# EAGLE design palm (EAGLE 9.3.0)
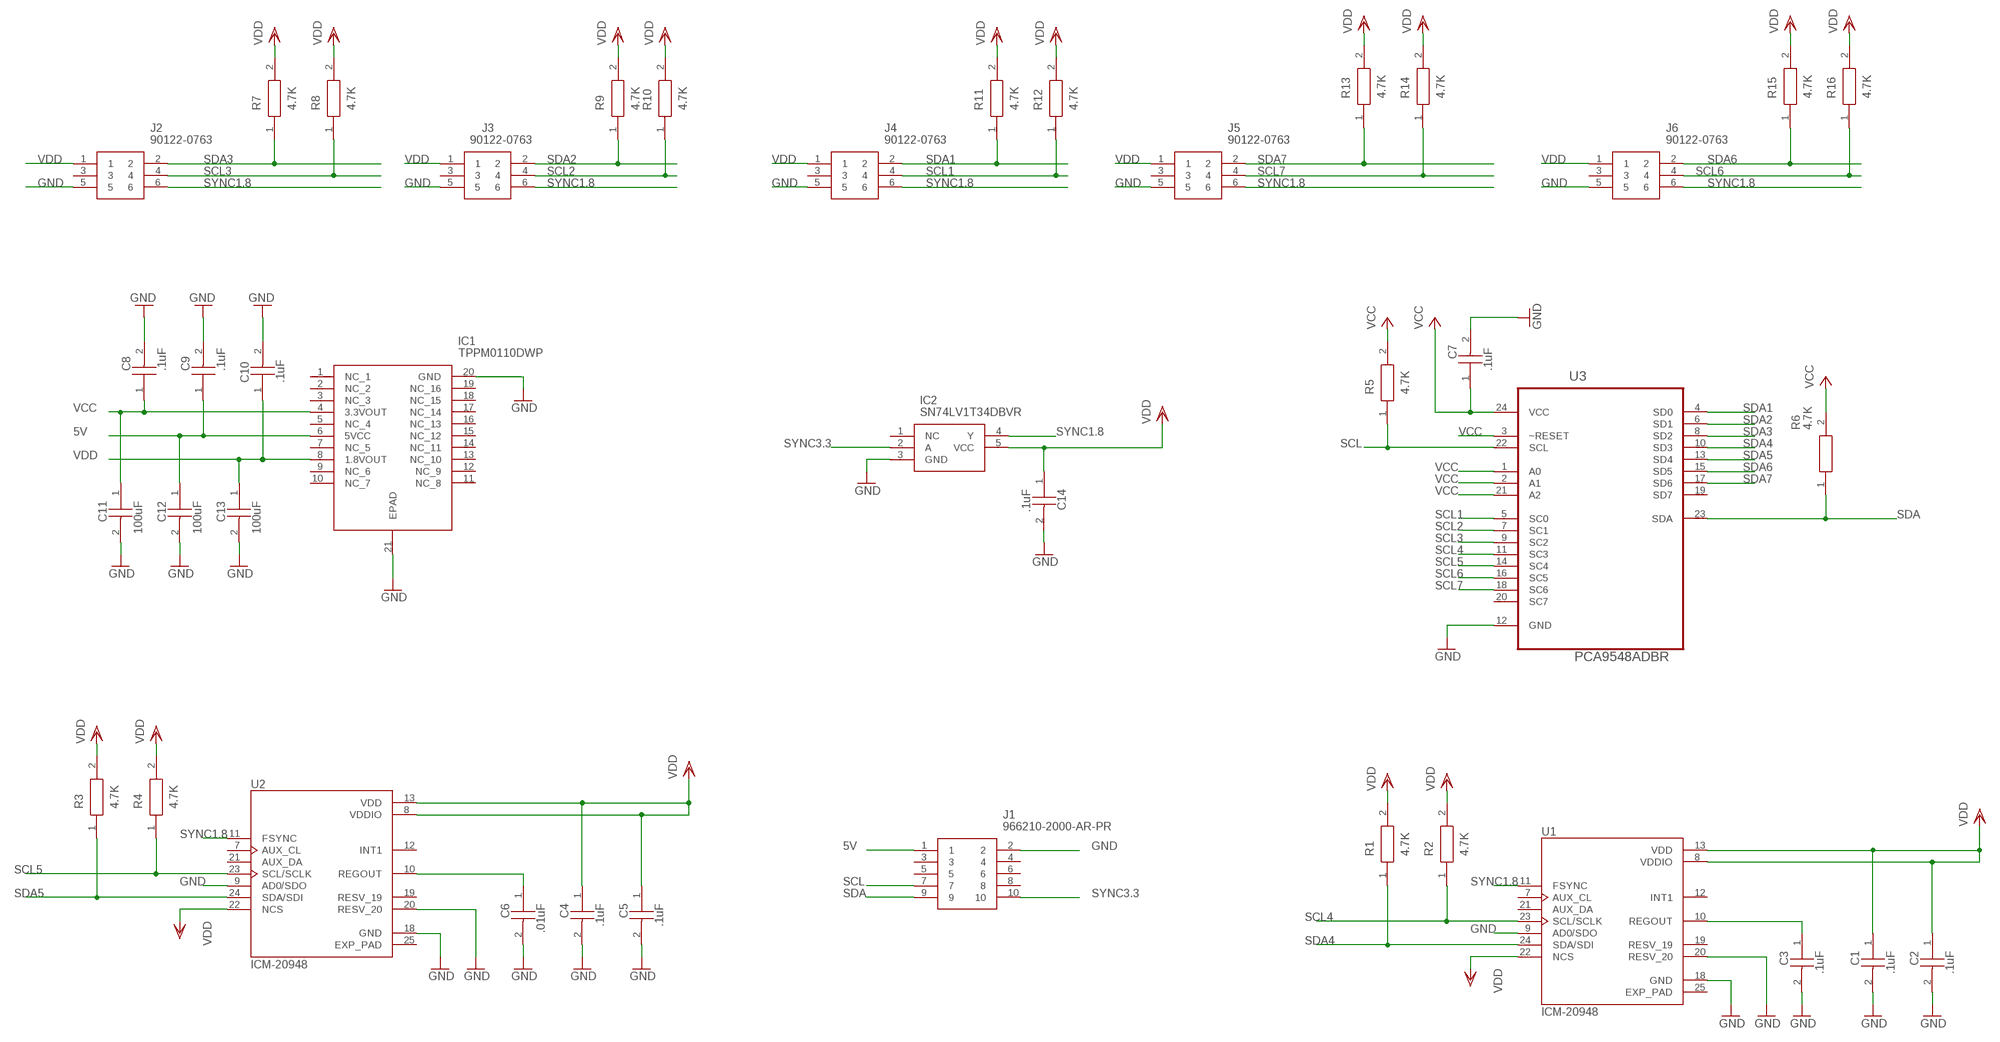
[diagram p0: schematic, sheet 1]

## Parts
C1  .1uF  C0805C104K6RACTU  [CAPC2012X88N]
C2  .1uF  C0805C104K6RACTU  [CAPC2012X88N]
C3  .1uF  C0805C104K6RACTU  [CAPC2012X88N]
C4  .1uF  C0805C104K6RACTU  [CAPC2012X88N]
C5  .1uF  C0805C104K6RACTU  [CAPC2012X88N]
C6  .01uF  C0805C104K6RACTU  [CAPC2012X88N]
C7  .1uF  C0805C104K6RACTU  [CAPC2012X88N]
C8  .1uF  C0805C104K6RACTU  [CAPC2012X88N]
C9  .1uF  C0805C104K6RACTU  [CAPC2012X88N]
C10  .1uF  C0805C104K6RACTU  [CAPC2012X88N]
C11  100uF  12106D107MAT2A  [CAPC3225X279N]
C12  100uF  12106D107MAT2A  [CAPC3225X279N]
C13  100uF  12106D107MAT2A  [CAPC3225X279N]
C14  .1uF  C0805C104K6RACTU  [CAPC2012X88N]
IC1  TPPM0110DWP  [SOIC127P1040X265-21N]
IC2  SN74LV1T34DBVR  [SOT95P280X145-5N]
J1  966210-2000-AR-PR  [966210-2000-AR-PR]
J2  90122-0763  [SHDR6W90P254_2X3_762X605X684P]
J3  90122-0763  [SHDR6W90P254_2X3_762X605X684P]
J4  90122-0763  [SHDR6W90P254_2X3_762X605X684P]
J5  90122-0763  [SHDR6W90P254_2X3_762X605X684P]
J6  90122-0763  [SHDR6W90P254_2X3_762X605X684P]
R1  4.7K  CRCW12064K70FKEBC  [RESC3216X60N]
R2  4.7K  CRCW12064K70FKEBC  [RESC3216X60N]
R3  4.7K  CRCW12064K70FKEBC  [RESC3216X60N]
R4  4.7K  CRCW12064K70FKEBC  [RESC3216X60N]
R5  4.7K  CRCW12064K70FKEBC  [RESC3216X60N]
R6  4.7K  CRCW12064K70FKEBC  [RESC3216X60N]
R7  4.7K  CRCW12064K70FKEBC  [RESC3216X60N]
R8  4.7K  CRCW12064K70FKEBC  [RESC3216X60N]
R9  4.7K  CRCW12064K70FKEBC  [RESC3216X60N]
R10  4.7K  CRCW12064K70FKEBC  [RESC3216X60N]
R11  4.7K  CRCW12064K70FKEBC  [RESC3216X60N]
R12  4.7K  CRCW12064K70FKEBC  [RESC3216X60N]
R13  4.7K  CRCW12064K70FKEBC  [RESC3216X60N]
R14  4.7K  CRCW12064K70FKEBC  [RESC3216X60N]
R15  4.7K  CRCW12064K70FKEBC  [RESC3216X60N]
R16  4.7K  CRCW12064K70FKEBC  [RESC3216X60N]
U1  ICM-20948  [QFN40P300X300X105-25N]
U2  ICM-20948  [QFN40P300X300X105-25N]
U3  PCA9548ADBR  [SOP65P780X200-24N]

## Nets
5V: C9.1 C12.1(C1) IC1.6(5VCC) J1.1
GND: C1.2 C2.2 C3.2 C4.2 C5.2 C6.2 C7.2 C8.2 C9.2 C10.2 C11.2(C2) C12.2(C2) C13.2(C2) C14.2 IC1.20(GND) IC1.21(EPAD) IC2.3(GND) J1.2 J2.5 J3.5 J4.5 J5.5 J6.5 U1.9(AD0/SDO) U1.18(GND) U1.20(RESV_20) U2.9(AD0/SDO) U2.18(GND) U2.20(RESV_20) U3.12(GND)
N$1: C6.1 U2.10(REGOUT)
N$3: C3.1 U1.10(REGOUT)
SCL: J1.7 R5.1 U3.22(SCL)
SCL1: J4.4 R12.1 U3.5(SC0)
SCL2: J3.4 R10.1 U3.7(SC1)
SCL3: J2.4 R8.1 U3.9(SC2)
SCL4: R2.1 U1.23(SCL/SCLK) U3.11(SC3)
SCL5: R4.1 U2.23(SCL/SCLK) U3.14(SC4)
SCL6: J6.4 R16.1 U3.16(SC5)
SCL7: J5.4 R14.1 U3.18(SC6)
SDA: J1.9 R6.1 U3.23(SDA)
SDA1: J4.2 R11.1 U3.4(SD0)
SDA2: J3.2 R9.1 U3.6(SD1)
SDA3: J2.2 R7.1 U3.8(SD2)
SDA4: R1.1 U1.24(SDA/SDI) U3.10(SD3)
SDA5: R3.1 U2.24(SDA/SDI) U3.13(SD4)
SDA6: J6.2 R15.1 U3.15(SD5)
SDA7: J5.2 R13.1 U3.17(SD6)
SYNC1.8: IC2.4(Y) J2.6 J3.6 J4.6 J5.6 J6.6 U1.11(FSYNC) U2.11(FSYNC)
SYNC3.3: IC2.2(A) J1.10
VCC: C7.1 C8.1 C11.1(C1) IC1.4(3.3VOUT) R5.2 R6.2 U3.1(A0) U3.2(A1) U3.3(~RESET) U3.21(A2) U3.24(VCC)
VDD: C1.1 C2.1 C4.1 C5.1 C10.1 C13.1(C1) C14.1 IC1.8(1.8VOUT) IC2.5(VCC) J2.1 J3.1 J4.1 J5.1 J6.1 R1.2 R2.2 R3.2 R4.2 R7.2 R8.2 R9.2 R10.2 R11.2 R12.2 R13.2 R14.2 R15.2 R16.2 U1.8(VDDIO) U1.13(VDD) U1.22(NCS) U2.8(VDDIO) U2.13(VDD) U2.22(NCS)
Unconnected: IC1.1(NC_1) IC1.2(NC_2) IC1.3(NC_3) IC1.5(NC_4) IC1.7(NC_5) IC1.9(NC_6) IC1.10(NC_7) IC1.11(NC_8) IC1.12(NC_9) IC1.13(NC_10) IC1.14(NC_11) IC1.15(NC_12) IC1.16(NC_13) IC1.17(NC_14) IC1.18(NC_15) IC1.19(NC_16) IC2.1(NC) J1.3 J1.4 J1.5 J1.6 J1.8 J2.3 J3.3 J4.3 J5.3 J6.3 U1.7(AUX_CL) U1.12(INT1) U1.19(RESV_19) U1.21(AUX_DA) U2.7(AUX_CL) U2.12(INT1) U2.19(RESV_19) U2.21(AUX_DA) U3.19(SD7) U3.20(SC7)

## Power pins joined to a net without a drawn wire
EXP_PAD: U1.25(EXP_PAD) U2.25(EXP_PAD)

## Library data of the parts
C1-C10 C14 = SamacSys_Parts:C0805C104K6RACTU: KEMET - C0805C104K6RACTU - CAP, MLCC, X7R, 0.1UF, 35V, 0805 Source: Datasheet <https://componentsearchengine.com/Datasheets/1/C0805C104K6RACTU.pdf>; DESCRIPTION: KEMET - C0805C104K6RACTU - CAP, MLCC, X7R, 0.1UF, 35V, 0805; HEIGHT: 0.88mm; MANUFACTURER_NAME: Kemet; MANUFACTURER_PART_NUMBER: C0805C104K6RACTU; MOUSER_PART_NUMBER: 80-C0805C104K6R
C11-C13 = SamacSys_Parts:12106D107MAT2A: Capacitor 1210 100UF 20% 6.3V Source: Datasheet <https://componentsearchengine.com/Datasheets/1/12106D107MAT2A.pdf>; DESCRIPTION: Capacitor 1210 100UF 20% 6.3V; HEIGHT: mm; MANUFACTURER_NAME: AVX; MANUFACTURER_PART_NUMBER: 12106D107MAT2A; MOUSER_PART_NUMBER: 581-12106D107MAT2A
IC1 = SamacSys_Parts:TPPM0110DWP: LDO Voltage Regulators Dual-Output 3.3V & 1.8V Source: Datasheet <http://www.ti.com/lit/ds/symlink/tppm0110.pdf>; DESCRIPTION: LDO Voltage Regulators Dual-Output 3.3V & 1.8V; HEIGHT: 2.65mm; MANUFACTURER_NAME: Texas Instruments; MANUFACTURER_PART_NUMBER: TPPM0110DWP; MOUSER_PART_NUMBER: 595-TPPM0110DWP
IC2 = SamacSys_Parts:SN74LV1T34DBVR: Single Power Supply BUFFER Logic Level Shifter (no enable) Source: Datasheet <http://www.ti.com/lit/gpn/sn74lv1t34>; DESCRIPTION: Single Power Supply BUFFER Logic Level Shifter (no enable); HEIGHT: 1.45mm; MANUFACTURER_NAME: Texas Instruments; MANUFACTURER_PART_NUMBER: SN74LV1T34DBVR; MOUSER_PART_NUMBER: 595-SN74LV1T34DBVR
J1 = SamacSys_Parts:966210-2000-AR-PR: Headers & Wire Housings 10P DUAL ENT DR SKT SMT LO PROFILE Source: Datasheet <https://componentsearchengine.com/Datasheets/1/966210-2000-AR-PR.pdf>; DESCRIPTION: Headers & Wire Housings 10P DUAL ENT DR SKT SMT LO PROFILE; HEIGHT: mm; MANUFACTURER_NAME: 3M; MANUFACTURER_PART_NUMBER: 966210-2000-AR-PR; MOUSER_PART_NUMBER: 517-9662102000ARPR
J2-J6 = SamacSys_Parts:90122-0763: Molex C-GRID III Series, Series Number 90122, 2.54mm Pitch 6 Way 2 Row Right Angle PCB Header, Solder Termination, 3A Source: Datasheet <http://www.mouser.com/datasheet/2/276/0901220763_PCB_HEADERS-230116.pdf>; DESCRIPTION: Molex C-GRID III Series, Series Number 90122, 2.54mm Pitch 6 Way 2 Row Right Angle PCB Header, Solder Termination, 3A; HEIGHT: 6.84mm; MANUFACTURER_NAME: Molex; MANUFACTURER_PART_NUMBER: 90122-0763; MOUSER_PART_NUMBER: 538-90122-0763; MOUSER_PRICE-STOCK: https://www.mouser.com/Search/Refine.aspx?Keyword=538-90122-0763
R1-R16 = SamacSys_Parts:CRCW12064K70FKEBC: Thick Film Resistors - SMD 1/4Watt 4.7Kohms 1% Commercial Use Source: Datasheet <https://componentsearchengine.com/Datasheets/1/CRCW12064K70FKEBC.pdf>; DESCRIPTION: Thick Film Resistors - SMD 1/4Watt 4.7Kohms 1% Commercial Use; HEIGHT: 0.6mm; MANUFACTURER_NAME: Vishay; MANUFACTURER_PART_NUMBER: CRCW12064K70FKEBC; MOUSER_PART_NUMBER: 71-CRCW12064K70FKEBC
U1 U2 = ICM-20948:ICM-20948: Axis=3 Axis Gyro+3 Axis Accel+Compass. Pin For Pin With m; DESCRIPTION: 9 Axis=3 Axis Gyro+3 Axis Accel+Compass. Pin For Pin With m; DIGI-KEY_PART_NUMBER: 1428-1123-1-ND; DIGI-KEY_PURCHASE_URL: https://www.digikey.com/product-detail/en/tdk-invensense/ICM-20948/1428-1123-1-ND/7062698?utm_source=snapeda&utm_medium=aggregator&utm_campaign=symbol; MF: TDK InvenSense; MP: ICM-20948; PACKAGE: QFN-24 InvenSense
U3 = PCA9548ADBR:PCA9548ADBR: 8-CHANNEL I2C SWITCH; AVAILABILITY: Unavailable; DESCRIPTION: 8-Channel I2C Switch With Reset 24-SSOP -40 to 85; MF: Texas Instruments; MP: PCA9548ADBR; PACKAGE: SSOP-24 Texas Instruments; PRICE: None

## Board
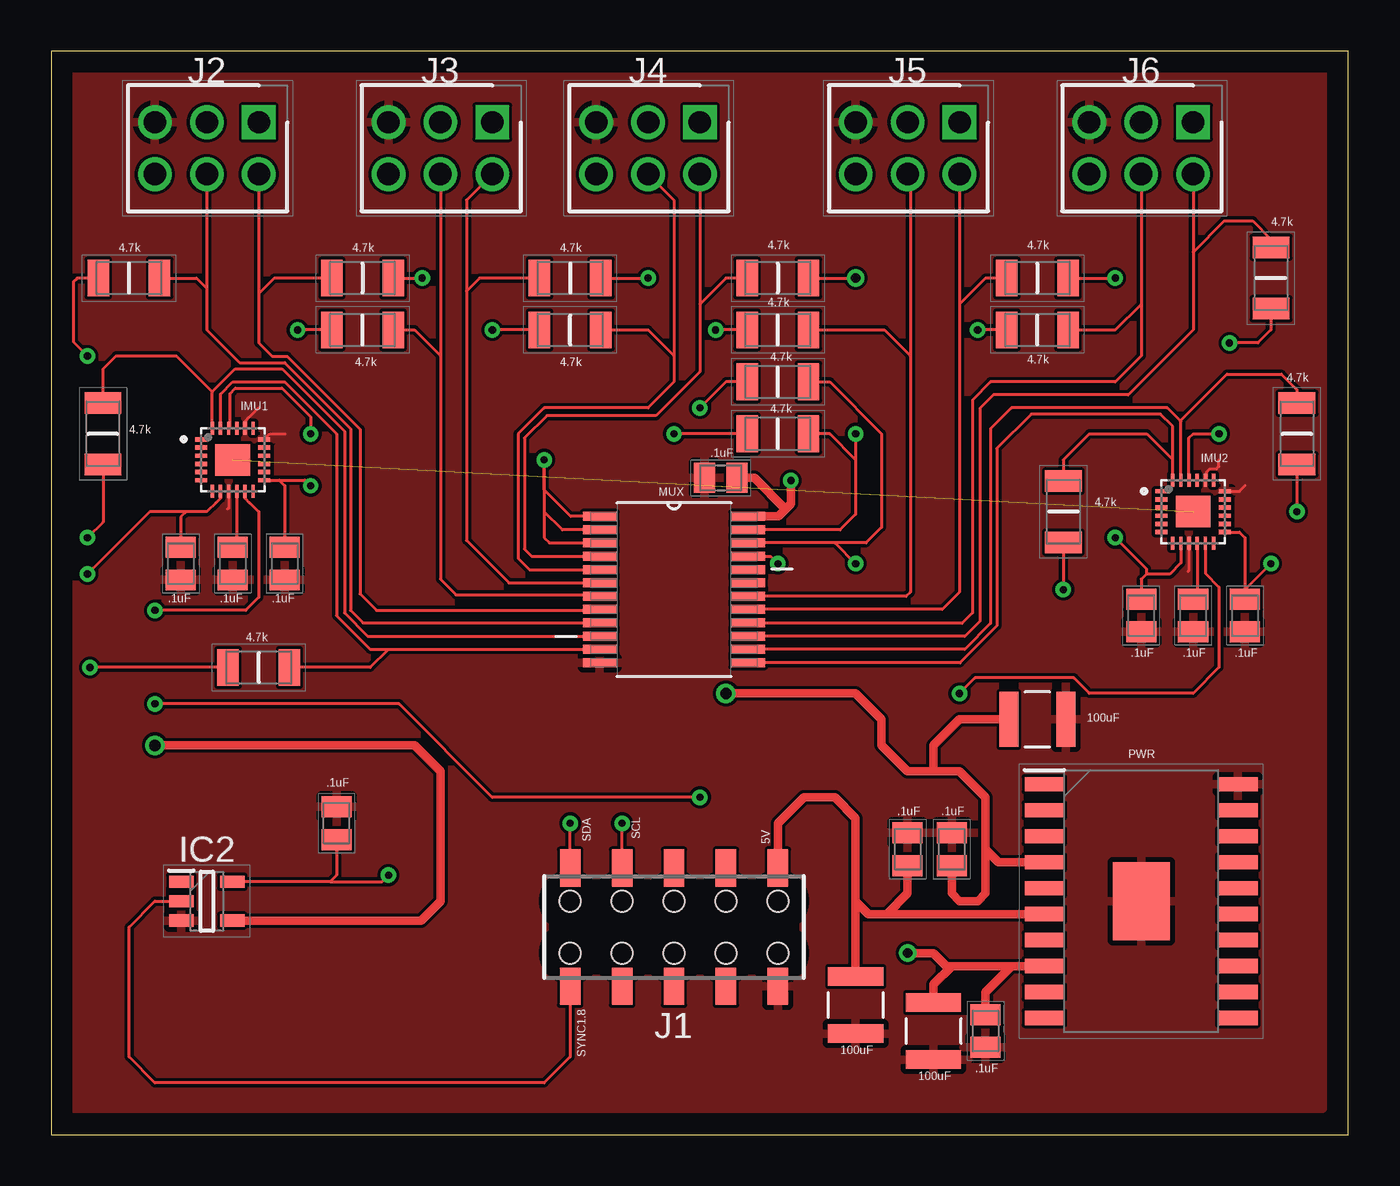
[diagram p1: board, top side]
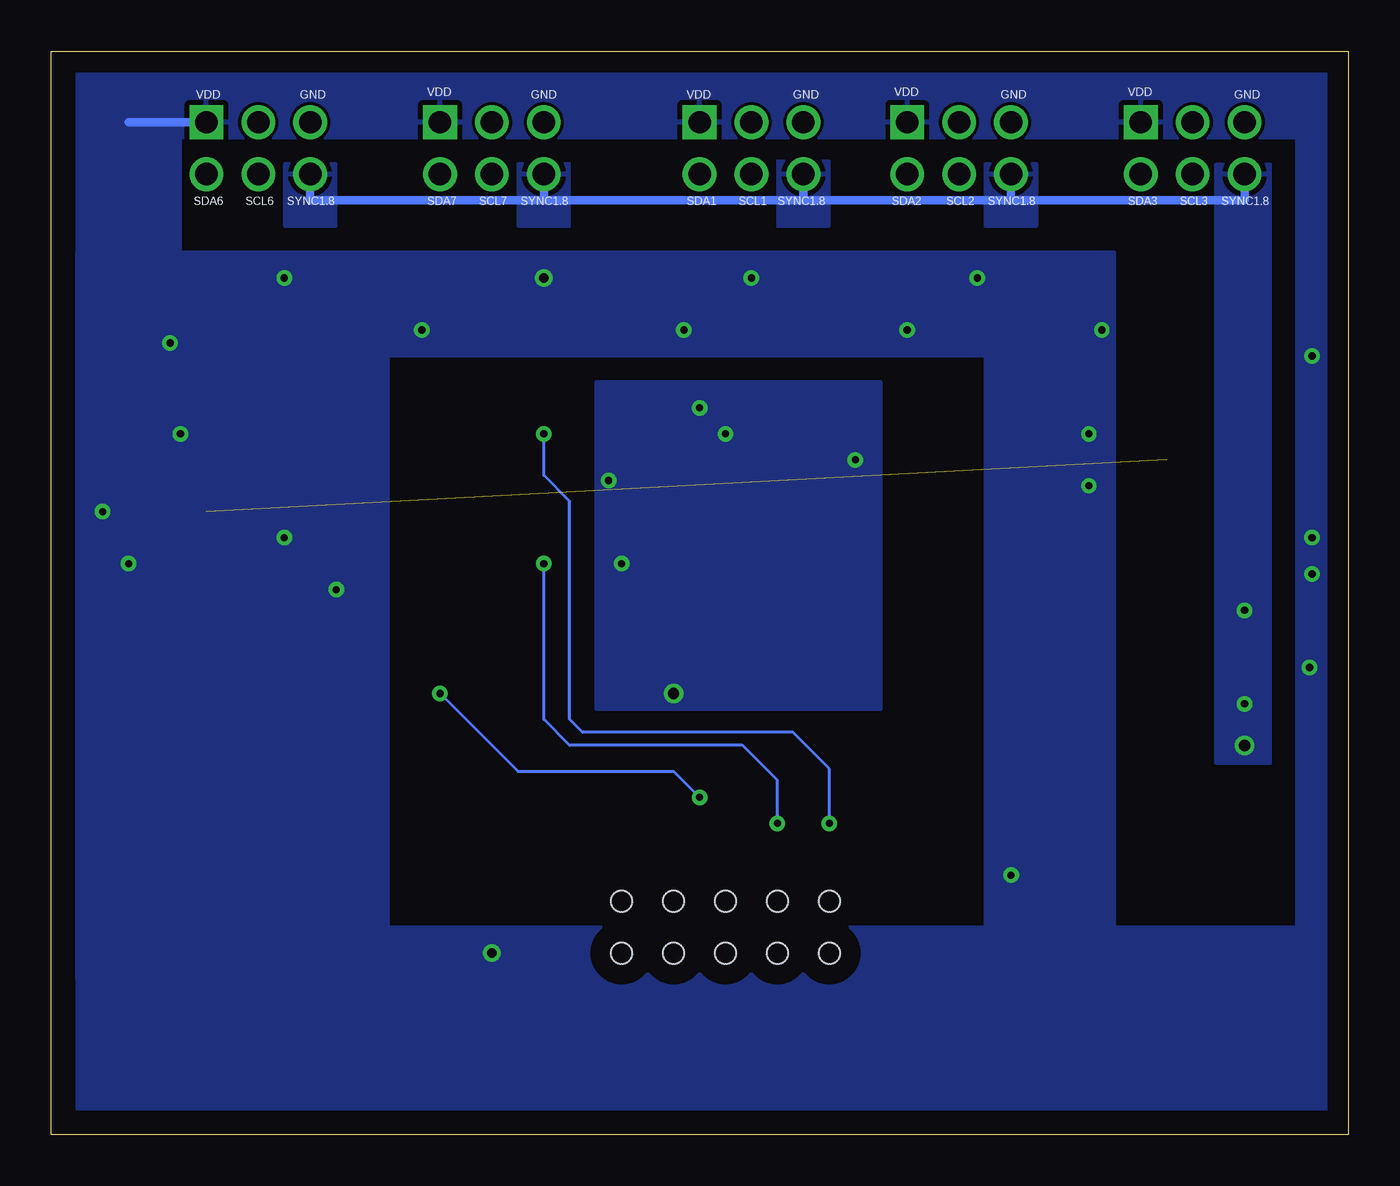
[diagram p2: board, bottom side, seen from below]

Size 63.48 x 53.01 mm. Coordinates in mm from the lower left corner, seen from the top.
Outline: 0,0 63.48,0 63.48,53.01 0,53.01 0,0
Copper layers (1*16): Top 0.035mm / dielectric 1.5mm / Bottom 0.035mm
Design rules "default": minimum track width 6mil, minimum drill 0.35mm, track to track 6mil, track to pad 6mil, pad to pad 6mil, via to via 6mil, smd to smd 6mil, copper to edge 40mil, drill to drill 6mil, minimum pad ring 10mil, minimum via ring 8mil, stop-mask expansion 4mil, vias tented up to drill 0mil, thermal gap 10mil

### Footprints (pad centres in the part's own frame; a part is rotated, then mirrored left to right if it is on the bottom)
CAPC2012X88N = smd 1.02 x 1.47: 1 -0.8,0; 2 0.8,0
CAPC3225X279N = smd 0.914 x 2.692: 1 -1.397,0; 2 1.397,0
SOIC127P1040X265-21N = smd 1.94 x 0.7: 1 -4.73,5.715; 2 -4.73,4.445; 3 -4.73,3.175; 4 -4.73,1.905; 5 -4.73,0.635; 6 -4.73,-0.635; 7 -4.73,-1.905; 8 -4.73,-3.175; 9 -4.73,-4.445; 10 -4.73,-5.715; 11 4.73,-5.715; 12 4.73,-4.445; 13 4.73,-3.175; 14 4.73,-1.905; 15 4.73,-0.635; 16 4.73,0.635; 17 4.73,1.905; 18 4.73,3.175; 19 4.73,4.445; 20 4.73,5.715 | smd 2.79 x 3.81: 21 0,0
SOT95P280X145-5N = smd 1.2 x 0.6: 1 -1.25,0.95; 2 -1.25,0; 3 -1.25,-0.95; 4 1.25,-0.95; 5 1.25,0.95
966210-2000-AR-PR = smd 1 x 1.82: 1 -5.08,-2.89; 2 -5.08,2.89; 3 -2.54,-2.89; 4 -2.54,2.89; 5 0,-2.89; 6 0,2.89; 7 2.54,-2.89; 8 2.54,2.89; 9 5.08,-2.89; 10 5.08,2.89 | hole 1.02: -5.08,-1.27; -5.08,1.27; -2.54,-1.27; -2.54,1.27; 0,-1.27; 0,1.27; 2.54,-1.27; 2.54,1.27; 5.08,-1.27; 5.08,1.27
SHDR6W90P254_2X3_762X605X684P = drill 1.1 pad 1.65 square: 1 0,0 | drill 1.1 pad 1.65: 2 0,2.54; 3 2.54,0; 4 2.54,2.54; 5 5.08,0; 6 5.08,2.54
RESC3216X60N = smd 1.05 x 1.8: 1 -1.5,0; 2 1.5,0
QFN40P300X300X105-25N = smd 0.64 x 0.22: 1 -1.545,1; 2 -1.545,0.6; 3 -1.545,0.2; 4 -1.545,-0.2; 5 -1.545,-0.6; 6 -1.545,-1; 13 1.545,-1; 14 1.545,-0.6; 15 1.545,-0.2; 16 1.545,0.2; 17 1.545,0.6; 18 1.545,1 | smd 0.22 x 0.64: 7 -1,-1.545; 8 -0.6,-1.545; 9 -0.2,-1.545; 10 0.2,-1.545; 11 0.6,-1.545; 12 1,-1.545; 19 1,1.545; 20 0.6,1.545; 21 0.2,1.545; 22 -0.2,1.545; 23 -0.6,1.545; 24 -1,1.545 | smd 1.7 x 1.54: 25 0,0
SOP65P780X200-24N = smd 1.651 x 0.432: 1 -3.632,3.581; 2 -3.632,2.921; 3 -3.632,2.286; 4 -3.632,1.626; 5 -3.632,0.965; 6 -3.632,0.33; 7 -3.632,-0.33; 8 -3.632,-0.965; 9 -3.632,-1.626; 10 -3.632,-2.286; 11 -3.632,-2.921; 12 -3.632,-3.581; 13 3.632,-3.581; 14 3.632,-2.921; 15 3.632,-2.286; 16 3.632,-1.626; 17 3.632,-0.965; 18 3.632,-0.33; 19 3.632,0.33; 20 3.632,0.965; 21 3.632,1.626; 22 3.632,2.286; 23 3.632,2.921; 24 3.632,3.581

### Placement (x,y rotation side)
C1  11.43,27.94 270 top
C2  6.35,27.94 270 top
C3  8.89,27.94 270 top
C4  58.42,25.4 270 top
C5  53.34,25.4 270 top
C6  55.88,25.4 270 top
C7  32.77,32.13 180 top
C8  44.07,13.97 90 top
C9  41.91,13.97 90 top
C10  45.72,5.08 270 top
C11  48.26,20.32 0 top
C12  39.37,6.35 270 top
C13  43.18,5.08 270 top
C14  13.97,15.24 90 top
IC1  53.34,11.43 0 top
IC2  7.62,11.43 0 top
J1  30.48,10.16 180 top
J2  10.16,49.53 180 top
J3  21.59,49.53 180 top
J4  31.75,49.53 180 top
J5  44.45,49.53 180 top
J6  55.88,49.53 180 top
R1  2.54,34.29 270 top
R2  10.16,22.86 180 top
R3  49.53,30.48 270 top
R4  60.96,34.29 270 top
R5  35.56,36.83 180 top
R6  35.56,34.29 180 top
R7  15.24,41.91 0 top
R8  3.81,41.91 180 top
R9  25.4,41.91 0 top
R10  15.24,39.37 180 top
R11  35.56,41.91 0 top
R12  25.4,39.37 180 top
R13  48.26,41.91 0 top
R14  35.56,39.37 180 top
R15  59.69,41.91 270 top
R16  48.26,39.37 180 top
U1  8.89,33.02 0 top
U2  55.88,30.48 0 top
U3  30.48,26.67 0 top

### Tracks (layer width: path | path; a pad name or v marks a point on that pad's centre or on a via)
5V
  Top 0.406: J1.1 35.56,15.24 36.83,16.51 38.35,16.51 39.37,15.49 39.37,11.43 | 39.37,11.43 40.01,10.79 40.89,10.79 | IC1.6 40.89,10.79 | C12.1 39.37,11.43 | C9.1 41.91,11.81 40.89,10.79
EXP_PAD  (1 unrouted)
GND
  Top 0.152: U1.9 8.69,30.66 8.64,30.61 | 10.16,35.56 9.71,35.11 9.7,35.11 9.49,34.9 U1.20 | U1.18 10.71,34.29 11.43,34.29 | U2.9 55.68,27.61 55.63,27.56 | 57.15,33.02 57.15,32.7 57.03,32.57 56.69,32.57 56.54,32.42 56.54,32.09 U2.20 | U2.18 58.15,31.48 58.42,31.75
  pour Top: 0.89,52.07 62.23,52.07 62.23,1.27 0.89,1.27
N$1
  Top 0.152: U2.10 56.08,26.4 C6.1
N$3
  Top 0.152: U1.10 9.09,28.94 C3.1
SCL  (via drill 0.35, 0.35 pad 0.55)
  Top 0.152: R5.1 38.1,36.83 40.64,34.29 40.64,29.72 39.88,28.96 38.35,28.96 | 38.35,28.96 U3.22 | 38.35,28.96 v39.37,27.94 | J1.7 v27.94,15.24
  Bottom 0.152: v27.94,15.24 27.94,17.35 29.64,19.05 38.1,19.05 39.37,20.32 v39.37,27.94
SCL1
  Top 0.152: U3.5 23.42,27.64 22.86,28.19 22.86,34.29 24.13,35.56 29.21,35.56 30.48,36.83 30.48,38.1 | J4.4 30.48,45.72 30.48,38.1 | 30.48,38.1 29.21,39.37 R12.1
SCL2
  Top 0.152: U3.7 26.77,26.42 19.81,26.42 19.05,27.18 19.05,38.1 | J3.4 19.05,38.1 | R10.1 17.78,39.37 19.05,38.1
SCL3
  Top 0.152: J2.4 7.62,41.4 | 7.62,41.4 7.62,39.37 9.22,37.77 11.43,37.77 14.66,34.54 14.66,25.65 15.27,25.04 U3.9 | 7.62,41.4 7.11,41.91 R8.1
SCL4
  Top 0.152: U1.23 8.29,36.23 8.89,36.83 11.43,36.83 13.97,34.29 13.97,25.4 15.62,23.75 16.51,23.75 | 16.51,23.75 U3.11 | R2.1 15.62,22.86 16.51,23.75
SCL5
  Top 0.152: U2.23 55.28,34.89 55.24,34.92 | 55.24,34.92 54.61,35.56 46.99,35.56 45.97,34.54 45.97,25.02 44.7,23.75 U3.14 | R4.1 60.96,36.45 60.2,37.21 57.53,37.21 55.24,34.92
SCL6
  Top 0.152: J6.4 53.34,40.64 | 53.34,40.64 53.34,38.1 52.07,36.83 45.97,36.83 45.09,35.94 45.09,25.53 44.58,25.02 34.14,25.02 U3.16 | R16.1 52.07,39.37 53.34,40.64
SCL7
  Top 0.152: J5.4 42.04,46.86 42.04,38.1 | 42.04,38.1 42.04,26.54 41.83,26.34 U3.18 | R14.1 40.77,39.37 42.04,38.1
SDA  (via drill 0.35, 0.35 pad 0.55)
  Top 0.152: v39.37,34.29 39.37,33.02 | 39.37,33.02 39.37,30.35 38.61,29.59 U3.23 | J1.9 v25.4,15.24 | 39.37,33.02 38.1,34.29 R6.1
  Bottom 0.152: v39.37,34.29 39.37,32.26 38.1,30.99 38.1,20.32 37.47,19.68 27.18,19.68 25.4,17.91 v25.4,15.24
SDA1
  Top 0.152: J4.2 31.75,40.64 | 31.75,40.64 31.75,37.34 29.59,35.18 24.26,35.18 23.16,34.09 23.16,28.65 23.52,28.3 U3.4 | R11.1 33.02,41.91 31.75,40.64
SDA2
  Top 0.152: U3.6 22.4,27 20.32,29.08 20.32,41.27 | J3.2 20.32,45.72 20.32,41.27 | R9.1 20.95,41.91 20.32,41.27
SDA3
  Top 0.152: U3.8 26.8,25.65 15.93,25.65 15.11,26.47 15.11,34.52 11.56,38.08 10.82,38.08 10.16,38.73 10.16,41.15 | J2.2 10.16,41.15 | R7.1 10.92,41.91 10.16,41.15
SDA4
  Top 0.152: U1.24 7.89,36.34 | 7.89,36.34 9.02,37.47 11.3,37.47 14.35,34.42 14.35,25.53 15.49,24.38 U3.10 | R1.1 2.54,37.47 3.17,38.1 6.13,38.1 7.89,36.34
SDA5
  Top 0.152: U2.24 54.88,33.02 | 54.88,33.02 54.88,34.66 54.28,35.26 47.95,35.26 46.28,33.58 46.28,24.89 44.48,23.09 U3.13 | 54.88,33.02 53.61,34.29 50.8,34.29 49.53,33.02 R3.1
SDA6
  Top 0.152: J6.2 55.88,43.18 | 55.88,43.18 55.88,39.37 52.7,36.2 46.1,36.2 45.47,35.56 45.47,25.15 44.7,24.38 U3.15 | 55.88,43.18 57.4,44.7 58.8,44.7 59.69,43.81 R15.1
SDA7
  Top 0.152: U3.17 43.61,25.7 44.45,26.54 44.45,40.64 | J5.2 44.45,40.64 | R13.1 45.72,41.91 44.45,40.64
SYNC1.8  (via drill 0.35, 0.55)
  Top 0.152: U2.11 56.48,27.47 57.15,26.8 57.15,22.86 55.88,21.59 50.8,21.59 50.04,22.35 45.21,22.35 v44.45,21.59 | v31.75,16.51 21.59,16.51 17.02,21.08 v5.08,21.08 | U1.11 9.49,31.14 9.7,30.93 9.71,30.93 10.16,30.48 10.16,26.29 9.53,25.65 v5.08,25.65
  Top 0.406: IC2.4 18.1,10.48 19.05,11.43 19.05,17.78 17.78,19.05 v5.08,19.05
  Bottom 0.152: v31.75,16.51 33.02,17.78 40.64,17.78 v44.45,21.59
  Bottom 0.406: J2.6 5.08,45.72 16.51,45.72 | 16.51,45.72 J3.6 | 16.51,45.72 26.67,45.72 | 26.67,45.72 J4.6 | 26.67,45.72 39.37,45.72 | 39.37,45.72 J5.6 | 39.37,45.72 50.8,45.72 J6.6
  pour Bottom: 3.81,18.16 6.48,18.16 6.48,47.5 3.81,47.5
  pour Bottom: 15.24,47.5 17.78,47.5 17.78,44.45 15.24,44.45
  pour Bottom: 25.4,47.62 27.94,47.62 27.94,44.45 25.4,44.45
  pour Bottom: 38.1,47.5 40.64,47.5 40.64,44.45 38.1,44.45
  pour Bottom: 49.53,47.5 52.07,47.5 52.07,44.45 49.53,44.45
SYNC3.3
  Top 0.152: J1.10 25.4,3.81 24.13,2.54 5.08,2.54 3.81,3.81 3.81,10.16 5.08,11.43 IC2.2
VCC  (via drill 0.35, 0.55)
  Top 0.152: R5.2 33.02,36.83 v31.75,35.56 | R6.2 v30.48,34.29 | U3.1 25.43,30.25 24.13,31.55 v24.13,33.02 24.13,30.48 | 24.13,30.48 24.13,29.21 24.38,28.96 U3.3 | 24.13,30.48 25.02,29.59 U3.2 | U3.21 35.2,28.3 v35.56,27.94
  Top 0.406: 45.72,13.97 45.72,16.51 44.45,17.78 43.18,17.78 | 45.72,13.97 46.35,13.34 IC1.4 | C8.1 44.07,11.81 44.45,11.43 45.34,11.43 45.72,11.81 45.72,13.97 | 43.18,17.78 41.91,17.78 40.64,19.05 40.64,20.32 39.37,21.59 v33.02,21.59 | C11.1 44.45,20.32 43.18,19.05 43.18,17.78 | 33.69,32.26 arc90 C7.1 34.42,32.13 35.94,30.61 | 34.14,30.23 arc-90 U3.24 35.59,30.25 35.94,30.61 | 35.94,30.61 36.2,30.86 v36.2,32
  pour Bottom: 22.86,36.83 36.83,36.83 36.83,20.83 22.86,20.83
VDD  (via drill 0.35, 0.45)
  Top 0.152: U1.8 8.29,31.14 8.08,30.93 8.07,30.93 7.62,30.48 6.6,30.48 | 6.6,30.48 6.35,30.23 C2.1 | C1.1 11.43,31.75 11.16,32.02 U1.13 12.43,32.02 v12.7,31.75 | U2.8 55.28,27.98 54.74,27.43 53.59,27.43 | 53.59,27.43 53.34,27.18 C5.1 | U2.13 58.15,29.48 58.42,29.21 58.42,26.67 | 58.42,26.67 C4.1 | C14.1 13.97,12.7 13.65,12.38 | 13.65,12.38 IC2.5 | R11.2 v39.37,41.91 | R14.2 v32.51,39.37 | R9.2 v29.21,41.91 | R12.2 v21.59,39.37 | R7.2 v18.16,41.91 | R13.2 v52.07,41.91 | R16.2 v45.34,39.37 | R15.2 59.69,39.37 59.05,38.73 v57.66,38.73 | R4.2 v60.96,30.48 | 58.42,26.67 v59.69,27.94 | R3.2 v49.53,26.67 | v52.07,29.21 53.59,27.69 53.59,27.43 | 13.65,12.38 16.19,12.38 v16.51,12.7 | U1.22 8.75,34.63 8.75,36.26 9.02,36.52 11.3,36.52 12.7,35.13 v12.7,34.29 | U2.22 55.68,34.09 55.88,34.29 v57.15,34.29 | R8.2 1.27,41.91 1.09,41.73 1.09,38.79 v1.78,38.1 | R1.2 2.54,29.97 v1.78,29.21 | 6.6,30.48 4.83,30.48 v1.78,27.43 | R2.2 v1.91,22.86 | R10.2 v12.06,39.37
  Top 0.406: IC1.8 46.99,8.26 | 46.99,8.26 44.07,8.26 | 44.07,8.26 43.18,7.37 C13.1 | 46.99,8.26 45.72,6.99 C10.1 | 44.07,8.26 43.81,8.26 43.18,8.89 v41.91,8.89
  Bottom 0.406: J6.1 59.69,49.53
  pour Bottom: 0,10.16 62.23,10.16 62.23,1.27 0,1.27
  pour Bottom: 11.43,43.18 62.23,43.18 62.23,38.1 11.43,38.1
  pour Bottom: 11.43,43.18 17.78,43.18 17.78,7.62 11.43,7.62
  pour Bottom: 46.99,43.18 46.99,7.62 62.23,7.62 62.23,43.18
  pour Bottom: 1.02,52.07 2.54,52.07 2.54,10.16 1.02,10.16
  pour Bottom: 2.54,52.07 57.15,52.07 57.4,51.82 57.4,48.77 2.54,48.77
  pour Bottom: 57.15,52.07 62.23,52.07 62.23,43.18 57.15,43.18

### Text on the board
tPlace: 4.7k | 4.7k | 4.7k | 4.7k | 4.7k | 4.7k | 4.7k | 4.7k | 4.7k | 4.7k | 4.7k | 4.7k | IMU1 | 4.7k | 4.7k | .1uF | IMU2 | MUX | 4.7k | .1uF | .1uF | .1uF | 4.7k | .1uF | .1uF | .1uF | 100uF | PWR | .1uF | .1uF | .1uF | SDA | SCL | 5V | SYNC1.8 | 100uF | 100uF | .1uF
bPlace: GND | VDD | GND | VDD | GND | VDD | GND | VDD | GND | VDD | SYNC1.8 | SCL3 | SDA3 | SYNC1.8 | SCL2 | SDA2 | SYNC1.8 | SCL1 | SDA1 | SYNC1.8 | SCL7 | SDA7 | SYNC1.8 | SCL6 | SDA6